# Altium schematic sheet [06]TemperatureSense.SchDoc
size A4; SheetNumber: 5; SheetTotal: 5
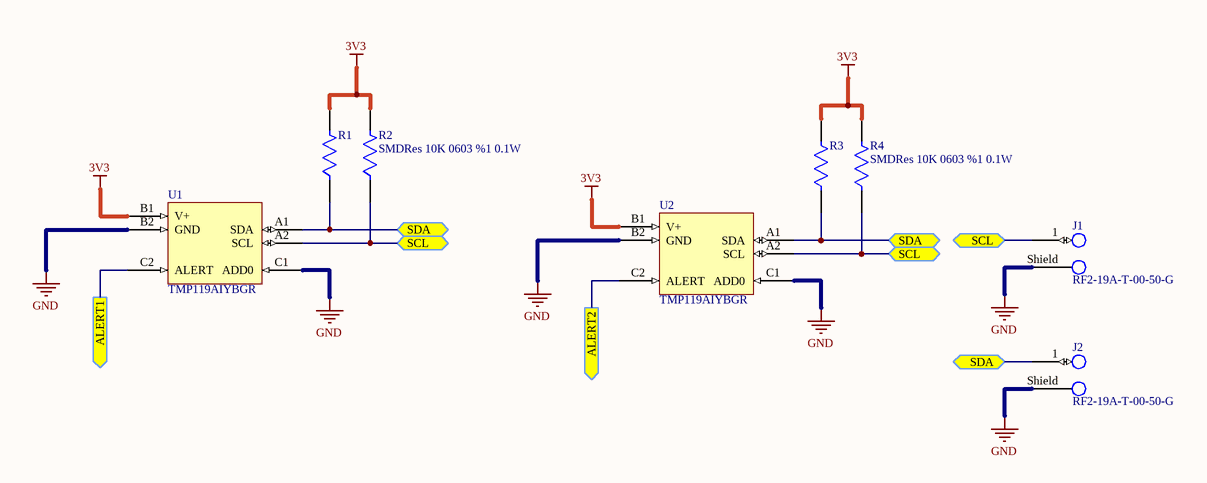
[diagram p0: [06]TemperatureSense.SchDoc]

## Parts
J1  RF2-19A-T-00-50-G  [RF2-19A-T-00-50-G]
J2  RF2-19A-T-00-50-G  [RF2-19A-T-00-50-G]
R1  SMDRes 10K 0603 %1 0.1W  [RESC1508X06N]  (value not drawn)
R2  SMDRes 10K 0603 %1 0.1W  [RESC1508X06N]
R3  SMDRes 10K 0603 %1 0.1W  [RESC1508X06N]  (value not drawn)
R4  SMDRes 10K 0603 %1 0.1W  [RESC1508X06N]
U1  TMP119AIYBGR  [BGA6C40P2X3_95X149X52]
U2  TMP119AIYBGR  [BGA6C40P2X3_95X149X52]

## Ports
ALERT1 (out), ALERT2 (out), SCL (bidir, see [06]TemperatureSense[2C], [06]TemperatureSense[4C]), SCL (bidir, see [06]TemperatureSense[4C]), SDA (bidir, see [06]TemperatureSense[2B], [06]TemperatureSense[4C]), SDA (bidir, see [06]TemperatureSense[4C])

## Nets
3V3: R1.2 R2.2 R3.2 R4.2 U1.B1(V+) U2.B1(V+)
GND: J1.Shield J2.Shield U1.B2(GND) U1.C1(ADD0) U2.B2(GND) U2.C1(ADD0)
ALERT1: U1.C2(ALERT) ; port ALERT1
ALERT2: U2.C2(ALERT) ; port ALERT2
SCL: J1.1 R2.1 R4.1 U1.A2(SCL) U2.A2(SCL) ; port SCL
SDA: J2.1 R1.1 R3.1 U1.A1(SDA) U2.A1(SDA) ; port SDA

## Notes on the sheet
- Title:
- Size:
- Date:
- A4
- Number:
- Time:
- Revision:
- Sheet
- of
- Project
- Drawn By :

## Library data of the parts
J1 J2 = CMP-00025-2: Rf Sma Connector
R1-R4 = CMP-00001-1-2: Res Thick Film 0603 10K Ohm 1% 0.1W(1/10W) ±100ppm/C Pad SMD T/R Automotive AEC-Q200; Manufacturer Number: RMCF0603FT10K0; Manufacturer: Stackpole Electronics Inc; Power: 0.1W; Mounting Type: Surface Mount; Temperature: -55°C up to 155°C; Digi-Key Part Number: RMCF0603FT10K0CT-ND; Tolerance: ±1%; Package: 0603; Mouser Part Number: 708-RMCF0603FT10K0
U1 U2 = CMP-00021-1: Temperature Sensor